# Altium schematic sheet Analog.SchDoc
size A4; SheetNumber: 1; SheetTotal: 5
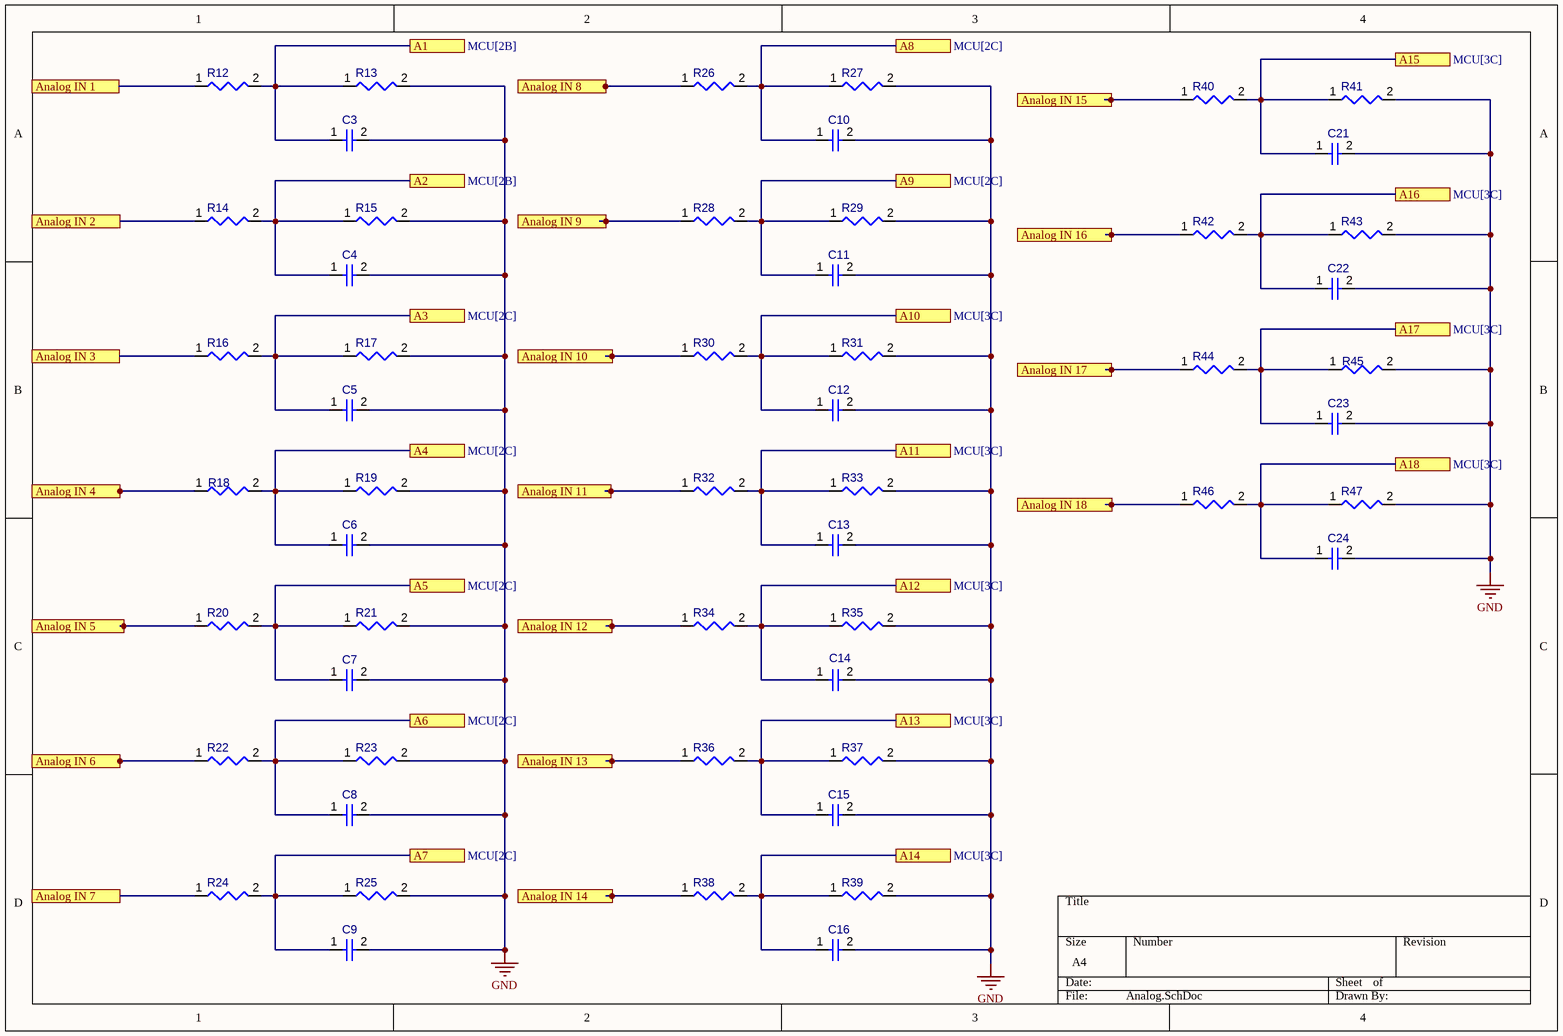
[diagram p0: Analog.SchDoc]

## Parts
C3  AC0402KRX7R7BB333  [CAPC1005X04N]  (value not drawn)
C4  AC0402KRX7R7BB333  [CAPC1005X04N]  (value not drawn)
C5  AC0402KRX7R7BB333  [CAPC1005X04N]  (value not drawn)
C6  AC0402KRX7R7BB333  [CAPC1005X04N]  (value not drawn)
C7  AC0402KRX7R7BB333  [CAPC1005X04N]  (value not drawn)
C8  AC0402KRX7R7BB333  [CAPC1005X04N]  (value not drawn)
C9  AC0402KRX7R7BB333  [CAPC1005X04N]  (value not drawn)
C10  AC0402KRX7R7BB333  [CAPC1005X04N]  (value not drawn)
C11  AC0402KRX7R7BB333  [CAPC1005X04N]  (value not drawn)
C12  AC0402KRX7R7BB333  [CAPC1005X04N]  (value not drawn)
C13  AC0402KRX7R7BB333  [CAPC1005X04N]  (value not drawn)
C14  AC0402KRX7R7BB333  [CAPC1005X04N]  (value not drawn)
C15  AC0402KRX7R7BB333  [CAPC1005X04N]  (value not drawn)
C16  AC0402KRX7R7BB333  [CAPC1005X04N]  (value not drawn)
C21  AC0402KRX7R7BB333  [CAPC1005X04N]  (value not drawn)
C22  AC0402KRX7R7BB333  [CAPC1005X04N]  (value not drawn)
C23  AC0402KRX7R7BB333  [CAPC1005X04N]  (value not drawn)
C24  AC0402KRX7R7BB333  [CAPC1005X04N]  (value not drawn)
R12  0402WGD2002TCE  [CAPC1005X04N]  (value not drawn)
R13  SY0402DE30KP  [CAPC1005X04N]  (value not drawn)
R14  0402WGD2002TCE  [CAPC1005X04N]  (value not drawn)
R15  SY0402DE30KP  [CAPC1005X04N]  (value not drawn)
R16  0402WGD2002TCE  [CAPC1005X04N]  (value not drawn)
R17  SY0402DE30KP  [CAPC1005X04N]  (value not drawn)
R18  0402WGD2002TCE  [CAPC1005X04N]  (value not drawn)
R19  SY0402DE30KP  [CAPC1005X04N]  (value not drawn)
R20  0402WGD2002TCE  [CAPC1005X04N]  (value not drawn)
R21  SY0402DE30KP  [CAPC1005X04N]  (value not drawn)
R22  0402WGD2002TCE  [CAPC1005X04N]  (value not drawn)
R23  SY0402DE30KP  [CAPC1005X04N]  (value not drawn)
R24  0402WGD2002TCE  [CAPC1005X04N]  (value not drawn)
R25  SY0402DE30KP  [CAPC1005X04N]  (value not drawn)
R26  0402WGD2002TCE  [CAPC1005X04N]  (value not drawn)
R27  SY0402DE30KP  [CAPC1005X04N]  (value not drawn)
R28  0402WGD2002TCE  [CAPC1005X04N]  (value not drawn)
R29  SY0402DE30KP  [CAPC1005X04N]  (value not drawn)
R30  0402WGD2002TCE  [CAPC1005X04N]  (value not drawn)
R31  SY0402DE30KP  [CAPC1005X04N]  (value not drawn)
R32  0402WGD2002TCE  [CAPC1005X04N]  (value not drawn)
R33  SY0402DE30KP  [CAPC1005X04N]  (value not drawn)
R34  0402WGD2002TCE  [CAPC1005X04N]  (value not drawn)
R35  SY0402DE30KP  [CAPC1005X04N]  (value not drawn)
R36  0402WGD2002TCE  [CAPC1005X04N]  (value not drawn)
R37  SY0402DE30KP  [CAPC1005X04N]  (value not drawn)
R38  0402WGD2002TCE  [CAPC1005X04N]  (value not drawn)
R39  SY0402DE30KP  [CAPC1005X04N]  (value not drawn)
R40  0402WGD2002TCE  [CAPC1005X04N]  (value not drawn)
R41  SY0402DE30KP  [CAPC1005X04N]  (value not drawn)
R42  0402WGD2002TCE  [CAPC1005X04N]  (value not drawn)
R43  SY0402DE30KP  [CAPC1005X04N]  (value not drawn)
R44  0402WGD2002TCE  [CAPC1005X04N]  (value not drawn)
R45  SY0402DE30KP  [CAPC1005X04N]  (value not drawn)
R46  0402WGD2002TCE  [CAPC1005X04N]  (value not drawn)
R47  SY0402DE30KP  [CAPC1005X04N]  (value not drawn)

## Ports
A1 (see MCU[2B]), A2 (see MCU[2B]), A3 (see MCU[2C]), A4 (see MCU[2C]), A5 (see MCU[2C]), A6 (see MCU[2C]), A7 (see MCU[2C]), A8 (see MCU[2C]), A9 (see MCU[2C]), A10 (see MCU[3C]), A11 (see MCU[3C]), A12 (see MCU[3C]), A13 (see MCU[3C]), A14 (see MCU[3C]), A15 (see MCU[3C]), A16 (see MCU[3C]), A17 (see MCU[3C]), A18 (see MCU[3C]), Analog IN 1, Analog IN 2, Analog IN 3, Analog IN 4, Analog IN 5, Analog IN 6, Analog IN 7, Analog IN 8, Analog IN 9, Analog IN 10, Analog IN 11, Analog IN 12, Analog IN 13, Analog IN 14, Analog IN 15, Analog IN 16, Analog IN 17, Analog IN 18

## Nets
GND: C3.2 C4.2 C5.2 C6.2 C7.2 C8.2 C9.2 C10.2 C11.2 C12.2 C13.2 C14.2 C15.2 C16.2 C21.2 C22.2 C23.2 C24.2 R13.2 R15.2 R17.2 R19.2 R21.2 R23.2 R25.2 R27.2 R29.2 R31.2 R33.2 R35.2 R37.2 R39.2 R41.2 R43.2 R45.2 R47.2
A1: C3.1 R12.2 R13.1 ; port A1
A2: C4.1 R14.2 R15.1 ; port A2
A3: C5.1 R16.2 R17.1 ; port A3
A4: C6.1 R18.2 R19.1 ; port A4
A5: C7.1 R20.2 R21.1 ; port A5
A6: C8.1 R22.2 R23.1 ; port A6
A7: C9.1 R24.2 R25.1 ; port A7
A8: C10.1 R26.2 R27.1 ; port A8
A9: C11.1 R28.2 R29.1 ; port A9
A10: C12.1 R30.2 R31.1 ; port A10
A11: C13.1 R32.2 R33.1 ; port A11
A12: C14.1 R34.2 R35.1 ; port A12
A13: C15.1 R36.2 R37.1 ; port A13
A14: C16.1 R38.2 R39.1 ; port A14
A15: C21.1 R40.2 R41.1 ; port A15
A16: C22.1 R42.2 R43.1 ; port A16
A17: C23.1 R44.2 R45.1 ; port A17
A18: C24.1 R46.2 R47.1 ; port A18
Analog IN 1: R12.1 ; port Analog IN 1
Analog IN 2: R14.1 ; port Analog IN 2
Analog IN 3: R16.1 ; port Analog IN 3
Analog IN 4: R18.1 ; port Analog IN 4
Analog IN 5: R20.1 ; port Analog IN 5
Analog IN 6: R22.1 ; port Analog IN 6
Analog IN 7: R24.1 ; port Analog IN 7
Analog IN 8: R26.1 ; port Analog IN 8
Analog IN 9: R28.1 ; port Analog IN 9
Analog IN 10: R30.1 ; port Analog IN 10
Analog IN 11: R32.1 ; port Analog IN 11
Analog IN 12: R34.1 ; port Analog IN 12
Analog IN 13: R36.1 ; port Analog IN 13
Analog IN 14: R38.1 ; port Analog IN 14
Analog IN 15: R40.1 ; port Analog IN 15
Analog IN 16: R42.1 ; port Analog IN 16
Analog IN 17: R44.1 ; port Analog IN 17
Analog IN 18: R46.1 ; port Analog IN 18

## Library data of the parts
C3-C16 C21-C24 = CMP-001-00107-1: 33nF capacitor
R12 R14 = CMP-009-00205-1: 20k; Case/Package: 0402
R13 R15 R17 R19 R21 R23 R25 R27 R29 R31 R33 R35 R37 R39 R41 R43 R45 R47 = CMP-009-00206-1: 30k Resistor
R16 R18 R20 R22 R24 R26 R28 R30 R32 R34 R36 R38 R40 R42 R44 R46 = CMP-009-00205-1: Case/Package: 0402